# EAGLE design Level_sensor (EAGLE 9.5.2)
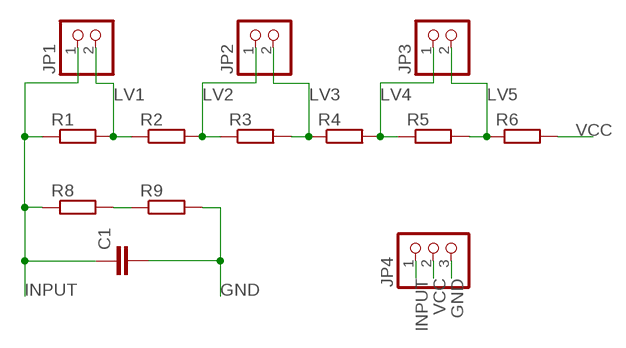
[diagram p0: schematic, sheet 1]

## Parts
C1  C-EU025-030X050  [C025-030X050]
JP1  PINHD-1X2  [1X02]
JP2  PINHD-1X2  [1X02]
JP3  PINHD-1X2  [1X02]
JP4  PINHD-1X3  [1X03]
R1  R-EU_0204/7  [0204/7]
R2  R-EU_0204/7  [0204/7]
R3  R-EU_0204/7  [0204/7]
R4  R-EU_0204/7  [0204/7]
R5  R-EU_0204/7  [0204/7]
R6  R-EU_0204/7  [0204/7]
R8  R-EU_0204/7  [0204/7]
R9  R-EU_0204/7  [0204/7]

## Nets
GND: C1.2 JP4.3 R9.2
INPUT: C1.1 JP1.1 JP4.1 R1.1 R8.1
LV1: JP1.2 R1.2 R2.1
LV2: JP2.1 R2.2 R3.1
LV3: JP2.2 R3.2 R4.1
LV4: JP3.1 R4.2 R5.1
LV5: JP3.2 R5.2 R6.1
N$5: R8.2 R9.1
VCC: JP4.2 R6.2

## Library data of the parts
C1 = rcl:C-EU: CAPACITOR, European symbol; SPICEPREFIX: C
JP1-JP3 = pinhead:PINHD-1X2: PIN HEADER
JP4 = pinhead:PINHD-1X3: PIN HEADER
R1-R6 R8 R9 = rcl:R-EU_: RESISTOR, European symbol; SPICEPREFIX: R

## Board
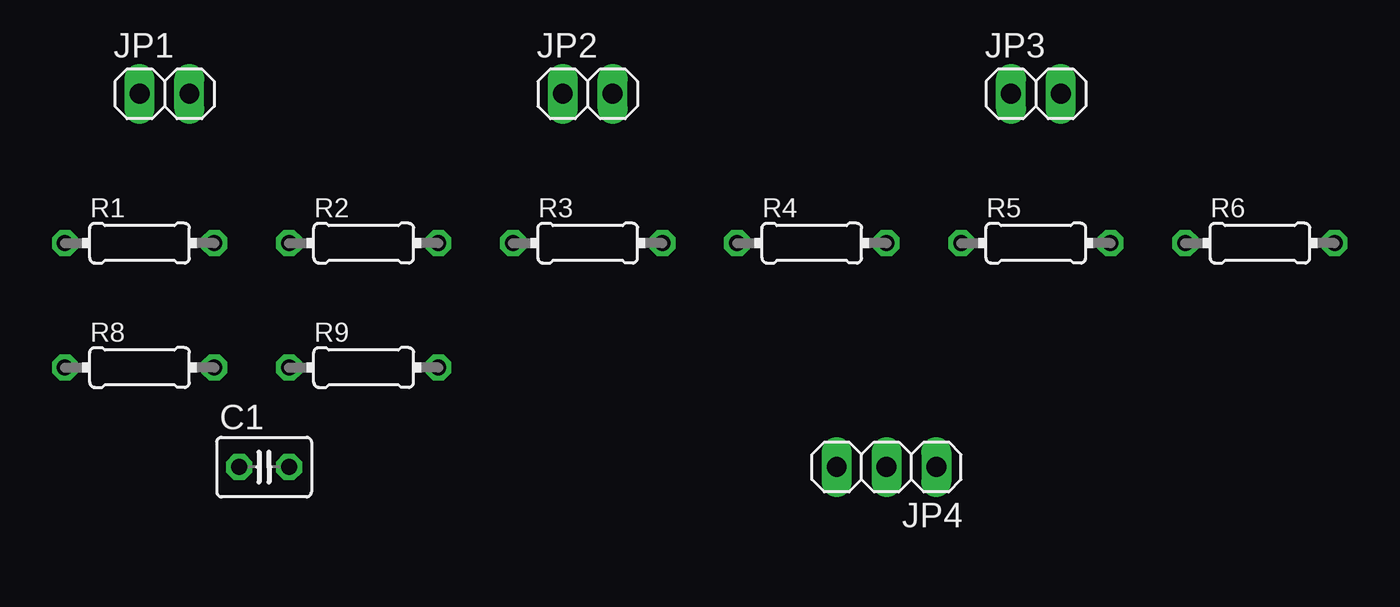
[diagram p1: board, top side]
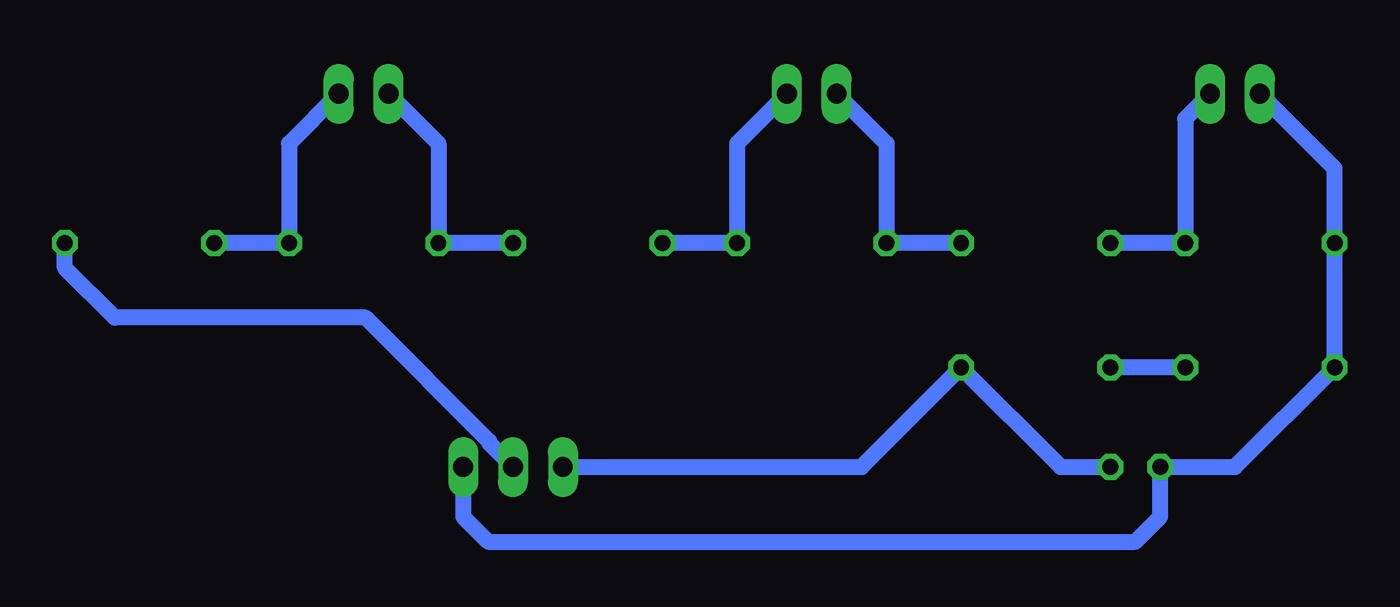
[diagram p2: board, bottom side, seen from below]

No outline drawn. Coordinates in mm, seen from the top.
Copper layers (1*16): Top 0.035mm / dielectric 1.5mm / Bottom 0.035mm
Design rules "default": minimum track width 6mil, minimum drill 0.35mm, track to track 6mil, track to pad 6mil, pad to pad 6mil, via to via 6mil, smd to smd 6mil, copper to edge 40mil, drill to drill 6mil, minimum pad ring 10mil, minimum via ring 8mil, stop-mask expansion 4mil, vias tented up to drill 0mil, thermal gap 10mil

### Footprints (pad centres in the part's own frame; a part is rotated, then mirrored left to right if it is on the bottom)
C025-030X050 = drill 0.813 octagon: 1 -1.27,0; 2 1.27,0
1X02 = drill 1.016 long: 1 -1.27,0; 2 1.27,0
1X03 = drill 1.016 long: 1 -2.54,0; 2 0,0; 3 2.54,0
0204/7 = drill 0.813 octagon: 1 -3.81,0; 2 3.81,0

### Placement (x,y rotation side)
C1  31.75,34.29 0 top
JP1  26.67,53.34 0 top
JP2  48.26,53.34 0 top
JP3  71.12,53.34 0 top
JP4  63.5,34.29 180 top
R1  25.4,45.72 0 top
R2  36.83,45.72 0 top
R3  48.26,45.72 0 top
R4  59.69,45.72 0 top
R5  71.12,45.72 0 top
R6  82.55,45.72 0 top
R8  25.4,39.37 0 top
R9  36.83,39.37 0 top

### Tracks (layer width: path | path; a pad name or v marks a point on that pad's centre or on a via)
GND
  Bottom 0.813: C1.2 35.56,34.29 R9.2 45.72,34.29 JP4.3
INPUT
  Bottom 0.813: JP1.1 21.59,49.53 R1.1 R8.1 26.67,34.29 C1.1 30.48,31.75 31.75,30.48 64.77,30.48 66.04,31.75 JP4.1
LV1
  Bottom 0.813: R2.1 R1.2 29.21,52.07 JP1.2
LV2
  Bottom 0.813: R2.2 R3.1 44.45,50.8 JP2.1
LV3
  Bottom 0.813: R4.1 R3.2 52.07,50.8 JP2.2
LV4
  Bottom 0.813: R4.2 R5.1 67.31,50.8 JP3.1
LV5
  Bottom 0.813: R6.1 R5.2 74.93,50.8 JP3.2
N$5
  Bottom 0.813: R8.2 R9.1
VCC
  Bottom 0.813: JP4.2 64.72,35.51 64.72,35.6 71.03,41.91 83.82,41.91 86.36,44.45 R6.2